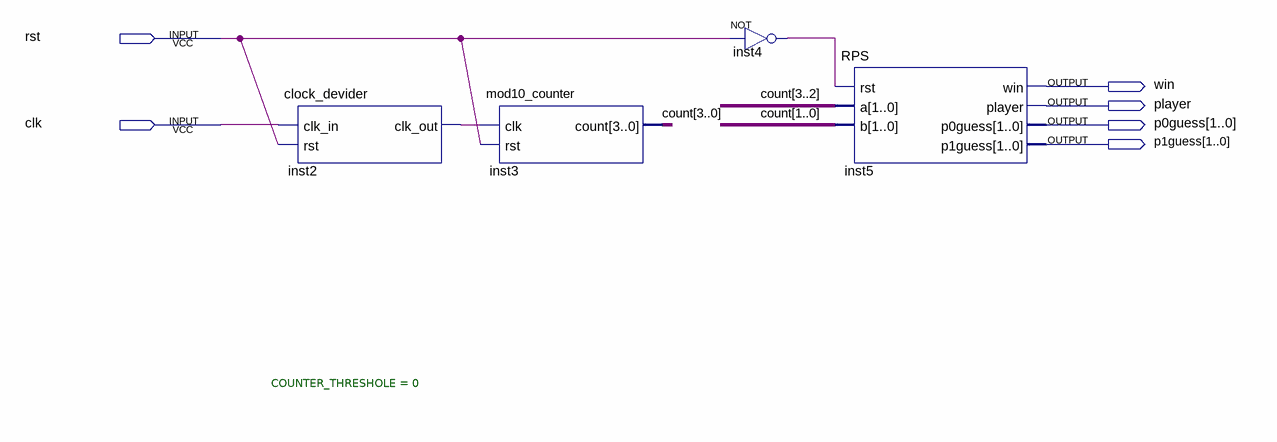
[diagram p0: schematic sheet]
// Quartus schematic block_counter.bdf as structural Verilog: 4 symbols, 6 pins
module block_counter (
  input  rst,
  input  clk,
  output win,
  output player,
  output [1:0] p0guess,
  output [1:0] p1guess
);

  wire inst2_clk_out, inst4_out;
  wire [3:0] count;

  clock_devider #(.COUNTER_THRESHOLE(0)) inst2 (.clk_in(clk), .rst(rst), .clk_out(inst2_clk_out));
  mod10_counter inst3 (.clk(inst2_clk_out), .rst(rst), .count(count));
  not inst4 (inst4_out, rst);
  RPS inst5 (
    .rst(inst4_out), .a(count[3:2]), .b(count[1:0]), .win(win), .player(player), .p0guess(p0guess),
    .p1guess(p1guess));
endmodule
